# Altium schematic sheet Power Regulator.SchDoc
size A
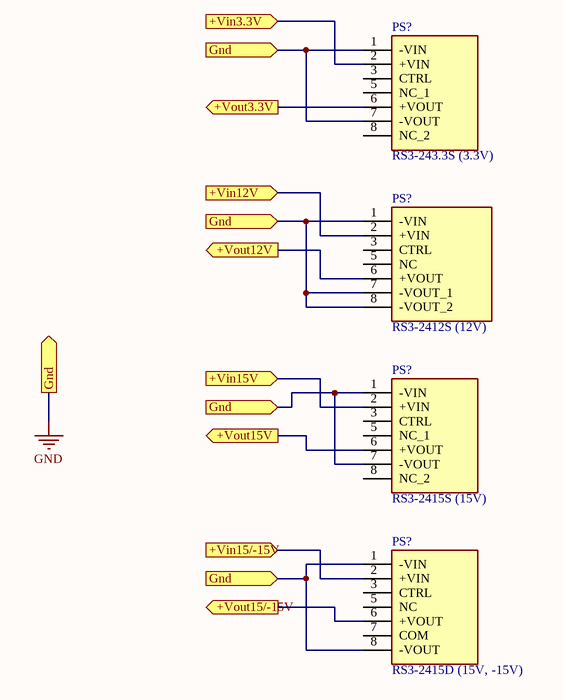
[diagram p0: Power Regulator.SchDoc]

## Parts
(Parts that share a designator on the sheet are numbered #1, #2 ... from top to bottom, then left to right.)
PS?#1  RS3-243.3S (3.3V)  [RS32433S]
PS?#2  RS3-2412S (12V)  [RS3]
PS?#3  RS3-2415S (15V)  [RS32415S]
PS?#4  RS3-2415D (15V, -15V)  [RS31215D]

## Ports
+Vin3.3V (in), +Vin12V (in), +Vin15/-15V (in), +Vin15V (in), +Vout3.3V (out), +Vout12V (out), +Vout15/-15V (out), +Vout15V (out), Gnd (in), Gnd (out)

## Nets
GND: PS?#1.1(-VIN) PS?#1.7(-VOUT) PS?#2.1(-VIN) PS?#2.7(-VOUT_1) PS?#2.8(-VOUT_2) PS?#3.1(-VIN) PS?#3.7(-VOUT) PS?#4.1(-VIN) PS?#4.8(-VOUT) ; port Gnd
+Vin3.3V: PS?#1.2(+VIN) ; port +Vin3.3V
+Vin12V: PS?#2.2(+VIN) ; port +Vin12V
+Vin15/-15V: PS?#4.2(+VIN) ; port +Vin15/-15V
+Vin15V: PS?#3.2(+VIN) ; port +Vin15V
+Vout3.3V: PS?#1.6(+VOUT) ; port +Vout3.3V
+Vout12V: PS?#2.6(+VOUT) ; port +Vout12V
+Vout15/-15V: PS?#4.6(+VOUT) ; port +Vout15/-15V
+Vout15V: PS?#3.6(+VOUT) ; port +Vout15V

Not connected (* = marked no-connect by the designer): PS?#1 3(CTRL) 5(NC_1) 8(NC_2); PS?#2 3(CTRL) 5(NC); PS?#3 3(CTRL) 5(NC_1) 8(NC_2); PS?#4 3(CTRL) 5(NC) 7(COM)

## Library data of the parts
PS?#1 = RS3-243.3S: Power Supply; Manufacturer_Name: RECOM Power; Datasheet Link: https://www.arrow.com/en/products/rs3-243.3s/recom-power; Height: 11.35mm; Manufacturer_Part_Number: RS3-243.3S; Mouser Part Number: 919-RS3-243.3S; Mouser Price/Stock: https://www.mouser.com/Search/Refine.aspx?Keyword=919-RS3-243.3S; Arrow Part Number: RS3-243.3S; Arrow Price/Stock: https://www.arrow.com/en/products/rs3-243.3s/recom-power
PS?#2 = RS3-2412S: Power Supply; Manufacturer_Name: RECOM Power; Datasheet Link: https://www.recom-power.com/pdf/Econoline/RS3-S_D_Z.pdf; Manufacturer_Part_Number: RS3-2412S; Mouser Part Number: 919-RS3-2412S; Mouser Price/Stock: https://www.mouser.co.uk/ProductDetail/RECOM-Power/RS3-2412S?qs=8OBu2JtKQqoMq12sMjx6jQ%3D%3D; Arrow Part Number: RS3-2412S; Arrow Price/Stock: https://www.arrow.com/en/products/rs3-2412s/recom-power?region=nac
PS?#3 = RS3-2415S: Power Supply; Manufacturer_Name: RECOM Power; Datasheet Link: https://www.recom-power.com/pdf/Econoline/RS3-S_D_Z.pdf; Height: 11.35mm; Manufacturer_Part_Number: RS3-2415S; Mouser Part Number: 919-RS3-2415S; Mouser Price/Stock: https://www.mouser.com/Search/Refine.aspx?Keyword=919-RS3-2415S
PS?#4 = RS3-2415D: Power Supply; Manufacturer_Name: RECOM Power; Datasheet Link: https://www.recom-power.com/pdf/Econoline/RS3-S_D_Z.pdf; Height: 11.6mm; Manufacturer_Part_Number: RS3-2415D; Mouser Part Number: 919-RS3-2415D; Mouser Price/Stock: https://www.mouser.co.uk/ProductDetail/RECOM-Power/RS3-2415D?qs=8OBu2JtKQqqT%2FgDxrHvRWg%3D%3D; Arrow Part Number: RS3-2415D; Arrow Price/Stock: https://www.arrow.com/en/products/rs3-2415d/recom-power